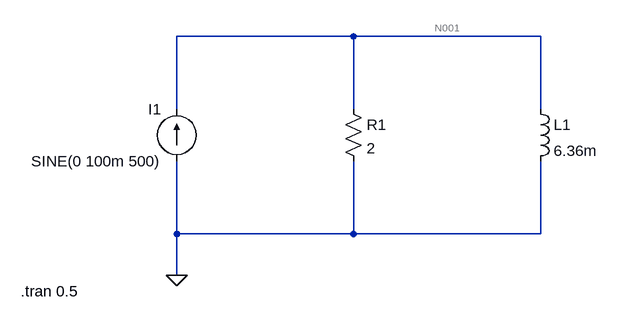
[diagram p0: schematic rl-parallel.asc]
rl-parallel.asc, the LTspice schematic file:
Version 4.1
SHEET 1 880 680
WIRE 288 16 16 16
WIRE 576 16 288 16
WIRE 16 128 16 16
WIRE 288 128 288 16
WIRE 576 128 576 16
WIRE 16 320 16 208
WIRE 288 320 288 208
WIRE 288 320 16 320
WIRE 576 320 576 208
WIRE 576 320 288 320
WIRE 16 384 16 320
FLAG 16 384 0
SYMBOL res 272 112 R0
SYMATTR InstName R1
SYMATTR Value 2
SYMBOL ind 560 112 R0
SYMATTR InstName L1
SYMATTR Value 6.36m
SYMBOL current 16 208 R180
WINDOW 0 24 80 Left 2
WINDOW 3 24 0 Left 2
WINDOW 123 0 0 Left 0
WINDOW 39 0 0 Left 0
SYMATTR InstName I1
SYMATTR Value SINE(0 100m 500)
TEXT -224 408 Left 2 !.tran 0.5

The netlist it stands for:
* rl-parallel.asc
R1 N001 0 2
L1 N001 0 6.36m
I1 0 N001 SINE(0 100m 500)
.tran 0.5
.backanno
.end

* Results of the author's LTspice run, read from the files saved beside the schematic
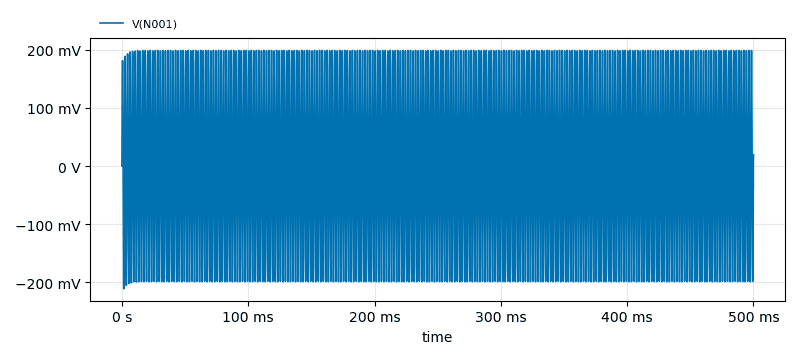
[diagram p1: Transient Analysis of rl-parallel.asc, plotted from the saved traces]
* Transient Analysis, 1 run:
*   V(N001): min -211.3 mV, max 199.2 mV, average -123.8 µV, rms 142.6 mV, last 19.47 mV